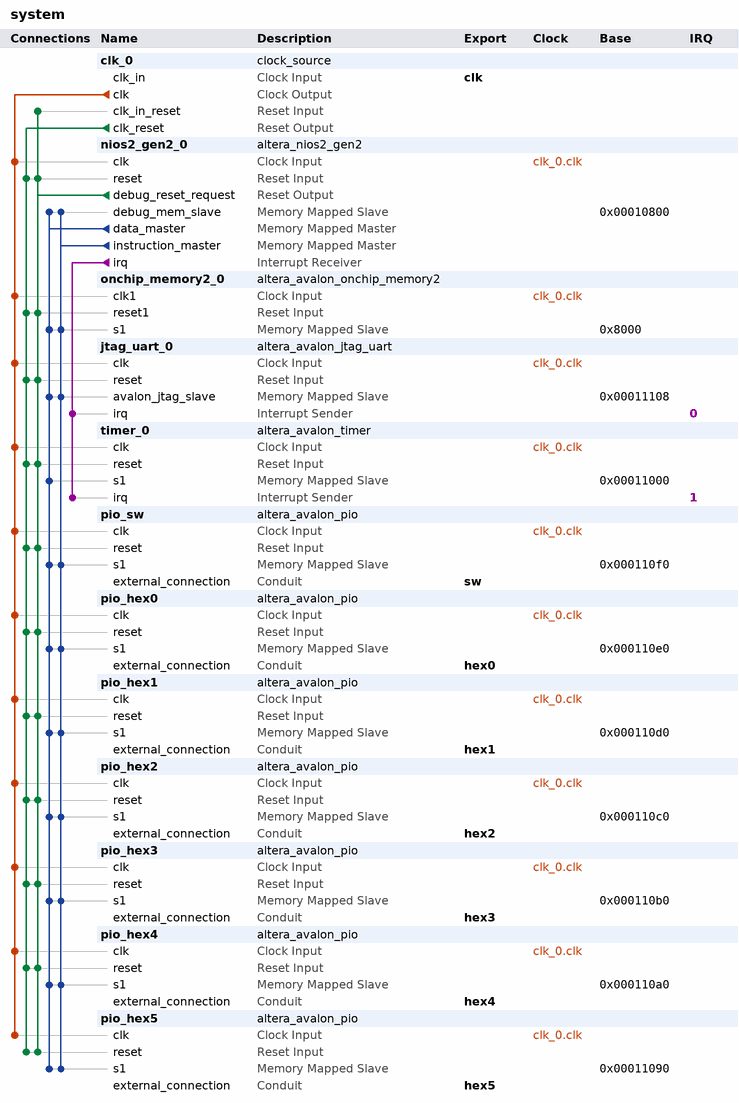
[diagram p0: system contents]
# Platform Designer (Qsys) system system, Cyclone V 5CSXFC6D6F31C6
# Parameters at their usual value, and those the tool derives, are not listed.
package require -exact qsys 18.1
create_system system
set_project_property DEVICE_FAMILY {Cyclone V}
set_project_property DEVICE 5CSXFC6D6F31C6

add_instance clk_0 clock_source 18.1
set_instance_parameter_value clk_0 clockFrequency 50000000

add_instance nios2_gen2_0 altera_nios2_gen2 18.1
set_instance_parameter_value nios2_gen2_0 dcache_size 2048
set_instance_parameter_value nios2_gen2_0 exceptionSlave onchip_memory2_0.s1
set_instance_parameter_value nios2_gen2_0 icache_size 4096
set_instance_parameter_value nios2_gen2_0 impl Tiny
set_instance_parameter_value nios2_gen2_0 resetSlave onchip_memory2_0.s1

add_instance onchip_memory2_0 altera_avalon_onchip_memory2 18.1
set_instance_parameter_value onchip_memory2_0 dataWidth 32
set_instance_parameter_value onchip_memory2_0 dualPort false
set_instance_parameter_value onchip_memory2_0 initMemContent true
set_instance_parameter_value onchip_memory2_0 initializationFileName onchip_mem.hex
set_instance_parameter_value onchip_memory2_0 memorySize 32768

add_instance jtag_uart_0 altera_avalon_jtag_uart 18.1
set_instance_parameter_value jtag_uart_0 simInteractiveOptions NO_INTERACTIVE_WINDOWS

add_instance timer_0 altera_avalon_timer 18.1
set_instance_parameter_value timer_0 period 1
set_instance_parameter_value timer_0 periodUnits MSEC

add_instance pio_sw altera_avalon_pio 18.1
set_instance_parameter_value pio_sw direction Input
set_instance_parameter_value pio_sw width 10

add_instance pio_hex0 altera_avalon_pio 18.1
set_instance_parameter_value pio_hex0 direction Output
set_instance_parameter_value pio_hex0 resetValue 255
set_instance_parameter_value pio_hex0 width 8

add_instance pio_hex1 altera_avalon_pio 18.1
set_instance_parameter_value pio_hex1 direction Output
set_instance_parameter_value pio_hex1 resetValue 255
set_instance_parameter_value pio_hex1 width 8

add_instance pio_hex2 altera_avalon_pio 18.1
set_instance_parameter_value pio_hex2 direction Output
set_instance_parameter_value pio_hex2 resetValue 255
set_instance_parameter_value pio_hex2 width 8

add_instance pio_hex3 altera_avalon_pio 18.1
set_instance_parameter_value pio_hex3 direction Output
set_instance_parameter_value pio_hex3 resetValue 255
set_instance_parameter_value pio_hex3 width 8

add_instance pio_hex4 altera_avalon_pio 18.1
set_instance_parameter_value pio_hex4 direction Output
set_instance_parameter_value pio_hex4 resetValue 255
set_instance_parameter_value pio_hex4 width 8

add_instance pio_hex5 altera_avalon_pio 18.1
set_instance_parameter_value pio_hex5 direction Output
set_instance_parameter_value pio_hex5 resetValue 255
set_instance_parameter_value pio_hex5 width 8

# connections
add_connection clk_0.clk jtag_uart_0.clk clock
add_connection clk_0.clk nios2_gen2_0.clk clock
add_connection clk_0.clk onchip_memory2_0.clk1 clock
add_connection clk_0.clk pio_hex0.clk clock
add_connection clk_0.clk pio_hex1.clk clock
add_connection clk_0.clk pio_hex2.clk clock
add_connection clk_0.clk pio_hex3.clk clock
add_connection clk_0.clk pio_hex4.clk clock
add_connection clk_0.clk pio_hex5.clk clock
add_connection clk_0.clk pio_sw.clk clock
add_connection clk_0.clk timer_0.clk clock
add_connection clk_0.clk_reset jtag_uart_0.reset reset
add_connection clk_0.clk_reset nios2_gen2_0.reset reset
add_connection clk_0.clk_reset onchip_memory2_0.reset1 reset
add_connection clk_0.clk_reset pio_hex0.reset reset
add_connection clk_0.clk_reset pio_hex1.reset reset
add_connection clk_0.clk_reset pio_hex2.reset reset
add_connection clk_0.clk_reset pio_hex3.reset reset
add_connection clk_0.clk_reset pio_hex4.reset reset
add_connection clk_0.clk_reset pio_hex5.reset reset
add_connection clk_0.clk_reset pio_sw.reset reset
add_connection clk_0.clk_reset timer_0.reset reset
add_connection nios2_gen2_0.debug_reset_request clk_0.clk_in_reset reset
add_connection nios2_gen2_0.debug_reset_request jtag_uart_0.reset reset
add_connection nios2_gen2_0.debug_reset_request nios2_gen2_0.reset reset
add_connection nios2_gen2_0.debug_reset_request onchip_memory2_0.reset1 reset
add_connection nios2_gen2_0.debug_reset_request pio_hex0.reset reset
add_connection nios2_gen2_0.debug_reset_request pio_hex1.reset reset
add_connection nios2_gen2_0.debug_reset_request pio_hex2.reset reset
add_connection nios2_gen2_0.debug_reset_request pio_hex3.reset reset
add_connection nios2_gen2_0.debug_reset_request pio_hex4.reset reset
add_connection nios2_gen2_0.debug_reset_request pio_hex5.reset reset
add_connection nios2_gen2_0.debug_reset_request pio_sw.reset reset
add_connection nios2_gen2_0.debug_reset_request timer_0.reset reset
add_connection nios2_gen2_0.data_master jtag_uart_0.avalon_jtag_slave avalon
set_connection_parameter_value nios2_gen2_0.data_master/jtag_uart_0.avalon_jtag_slave baseAddress 0x00011108
add_connection nios2_gen2_0.data_master nios2_gen2_0.debug_mem_slave avalon
set_connection_parameter_value nios2_gen2_0.data_master/nios2_gen2_0.debug_mem_slave baseAddress 0x00010800
add_connection nios2_gen2_0.data_master onchip_memory2_0.s1 avalon
set_connection_parameter_value nios2_gen2_0.data_master/onchip_memory2_0.s1 baseAddress 0x8000
add_connection nios2_gen2_0.data_master pio_hex0.s1 avalon
set_connection_parameter_value nios2_gen2_0.data_master/pio_hex0.s1 baseAddress 0x000110e0
add_connection nios2_gen2_0.data_master pio_hex1.s1 avalon
set_connection_parameter_value nios2_gen2_0.data_master/pio_hex1.s1 baseAddress 0x000110d0
add_connection nios2_gen2_0.data_master pio_hex2.s1 avalon
set_connection_parameter_value nios2_gen2_0.data_master/pio_hex2.s1 baseAddress 0x000110c0
add_connection nios2_gen2_0.data_master pio_hex3.s1 avalon
set_connection_parameter_value nios2_gen2_0.data_master/pio_hex3.s1 baseAddress 0x000110b0
add_connection nios2_gen2_0.data_master pio_hex4.s1 avalon
set_connection_parameter_value nios2_gen2_0.data_master/pio_hex4.s1 baseAddress 0x000110a0
add_connection nios2_gen2_0.data_master pio_hex5.s1 avalon
set_connection_parameter_value nios2_gen2_0.data_master/pio_hex5.s1 baseAddress 0x00011090
add_connection nios2_gen2_0.data_master pio_sw.s1 avalon
set_connection_parameter_value nios2_gen2_0.data_master/pio_sw.s1 baseAddress 0x000110f0
add_connection nios2_gen2_0.data_master timer_0.s1 avalon
set_connection_parameter_value nios2_gen2_0.data_master/timer_0.s1 baseAddress 0x00011000
add_connection nios2_gen2_0.instruction_master jtag_uart_0.avalon_jtag_slave avalon
set_connection_parameter_value nios2_gen2_0.instruction_master/jtag_uart_0.avalon_jtag_slave baseAddress 0x00011108
add_connection nios2_gen2_0.instruction_master nios2_gen2_0.debug_mem_slave avalon
set_connection_parameter_value nios2_gen2_0.instruction_master/nios2_gen2_0.debug_mem_slave baseAddress 0x00010800
add_connection nios2_gen2_0.instruction_master onchip_memory2_0.s1 avalon
set_connection_parameter_value nios2_gen2_0.instruction_master/onchip_memory2_0.s1 baseAddress 0x8000
add_connection nios2_gen2_0.instruction_master pio_hex0.s1 avalon
set_connection_parameter_value nios2_gen2_0.instruction_master/pio_hex0.s1 baseAddress 0x000110e0
add_connection nios2_gen2_0.instruction_master pio_hex1.s1 avalon
set_connection_parameter_value nios2_gen2_0.instruction_master/pio_hex1.s1 baseAddress 0x000110d0
add_connection nios2_gen2_0.instruction_master pio_hex2.s1 avalon
set_connection_parameter_value nios2_gen2_0.instruction_master/pio_hex2.s1 baseAddress 0x000110c0
add_connection nios2_gen2_0.instruction_master pio_hex3.s1 avalon
set_connection_parameter_value nios2_gen2_0.instruction_master/pio_hex3.s1 baseAddress 0x000110b0
add_connection nios2_gen2_0.instruction_master pio_hex4.s1 avalon
set_connection_parameter_value nios2_gen2_0.instruction_master/pio_hex4.s1 baseAddress 0x000110a0
add_connection nios2_gen2_0.instruction_master pio_hex5.s1 avalon
set_connection_parameter_value nios2_gen2_0.instruction_master/pio_hex5.s1 baseAddress 0x00011090
add_connection nios2_gen2_0.instruction_master pio_sw.s1 avalon
set_connection_parameter_value nios2_gen2_0.instruction_master/pio_sw.s1 baseAddress 0x000110f0
add_connection nios2_gen2_0.irq jtag_uart_0.irq interrupt
set_connection_parameter_value nios2_gen2_0.irq/jtag_uart_0.irq irqNumber 0
add_connection nios2_gen2_0.irq timer_0.irq interrupt
set_connection_parameter_value nios2_gen2_0.irq/timer_0.irq irqNumber 1

# exported interfaces
add_interface clk clock sink
set_interface_property clk EXPORT_OF clk_0.clk_in
add_interface hex0 conduit end
set_interface_property hex0 EXPORT_OF pio_hex0.external_connection
add_interface hex1 conduit end
set_interface_property hex1 EXPORT_OF pio_hex1.external_connection
add_interface hex2 conduit end
set_interface_property hex2 EXPORT_OF pio_hex2.external_connection
add_interface hex3 conduit end
set_interface_property hex3 EXPORT_OF pio_hex3.external_connection
add_interface hex4 conduit end
set_interface_property hex4 EXPORT_OF pio_hex4.external_connection
add_interface hex5 conduit end
set_interface_property hex5 EXPORT_OF pio_hex5.external_connection
add_interface sw conduit end
set_interface_property sw EXPORT_OF pio_sw.external_connection

set_interconnect_requirement {$system} qsys_mm.clockCrossingAdapter HANDSHAKE
set_interconnect_requirement {$system} qsys_mm.enableEccProtection FALSE
set_interconnect_requirement {$system} qsys_mm.insertDefaultSlave FALSE
set_interconnect_requirement {$system} qsys_mm.maxAdditionalLatency 1

save_system system.qsys
